# Altium project c车ccd3.0.PrjPCB
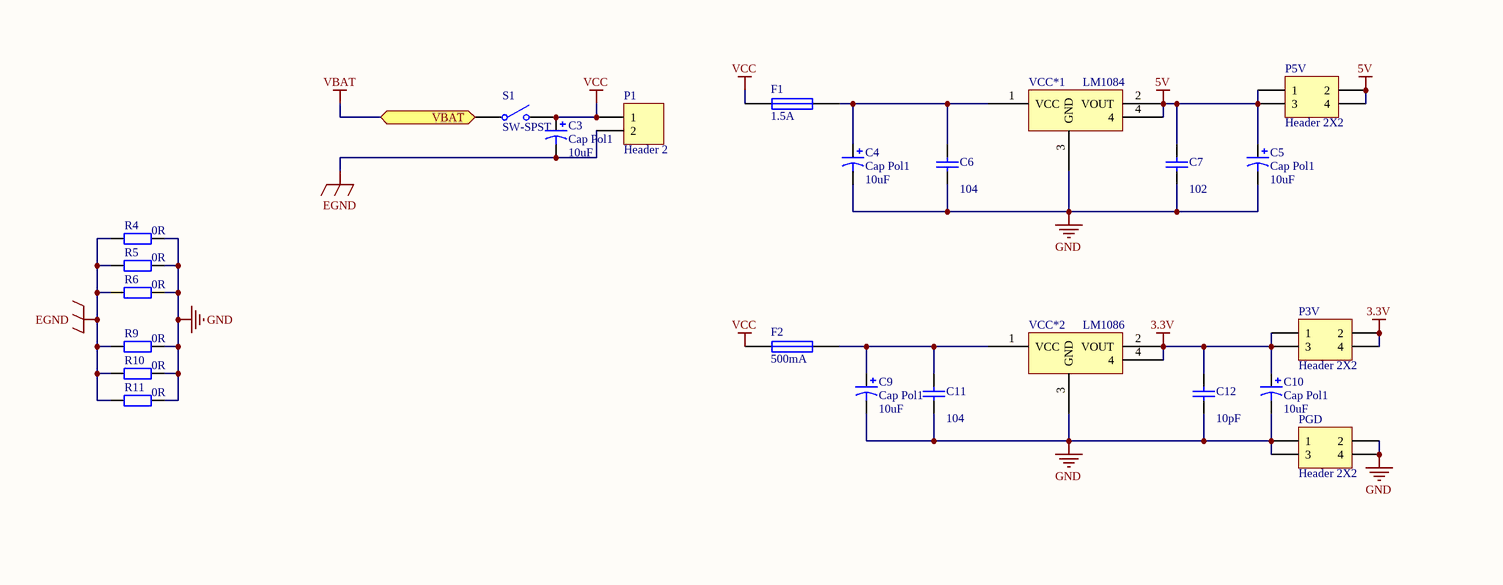
[diagram p0: k60最小系统.SchDoc, top left]
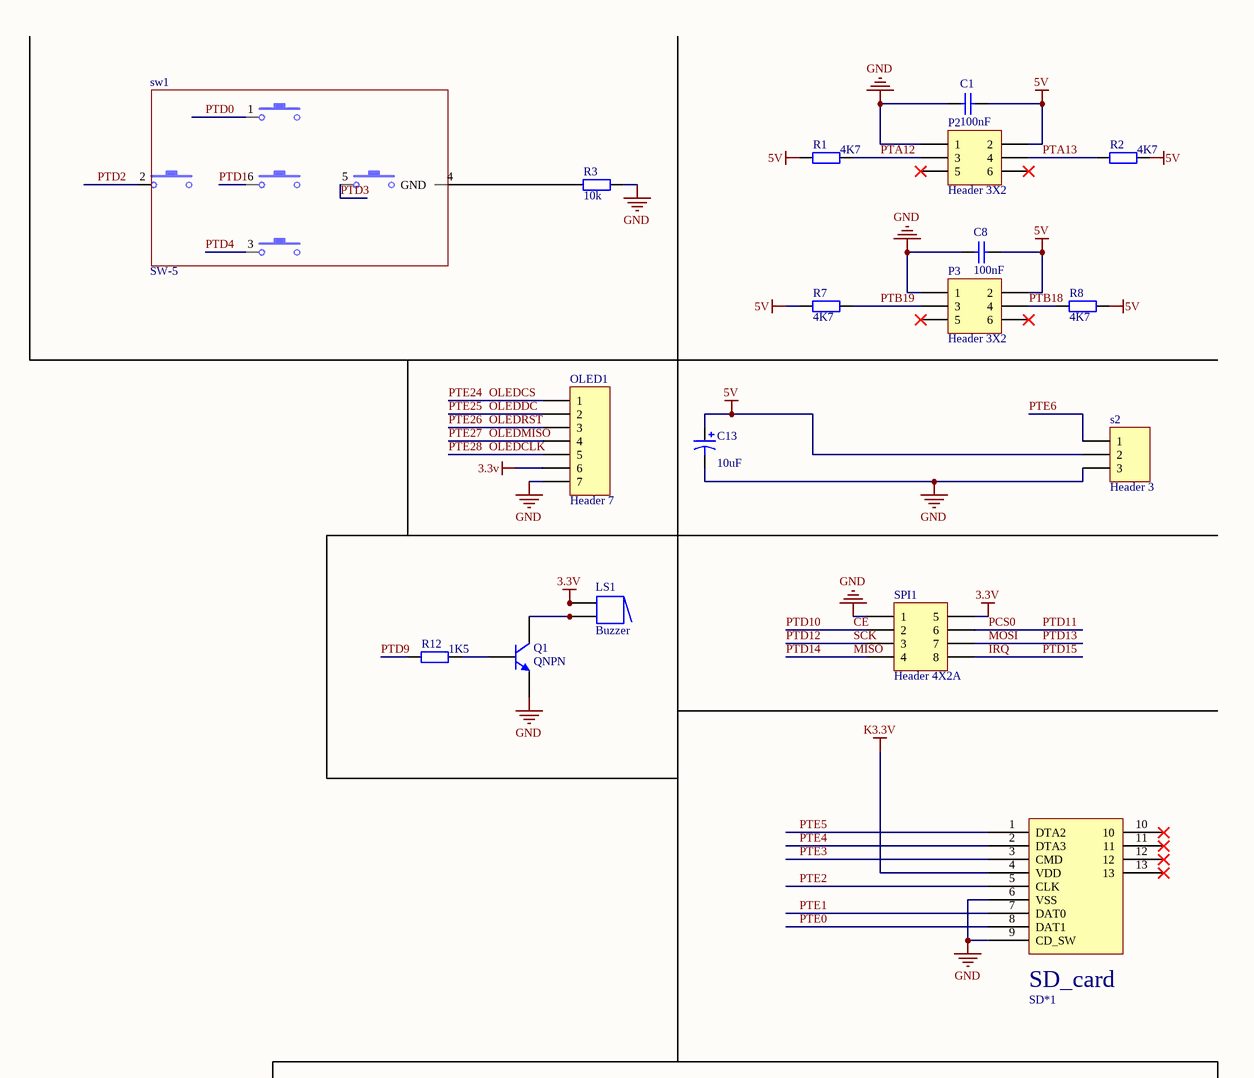
[diagram p1: k60最小系统.SchDoc, top right]
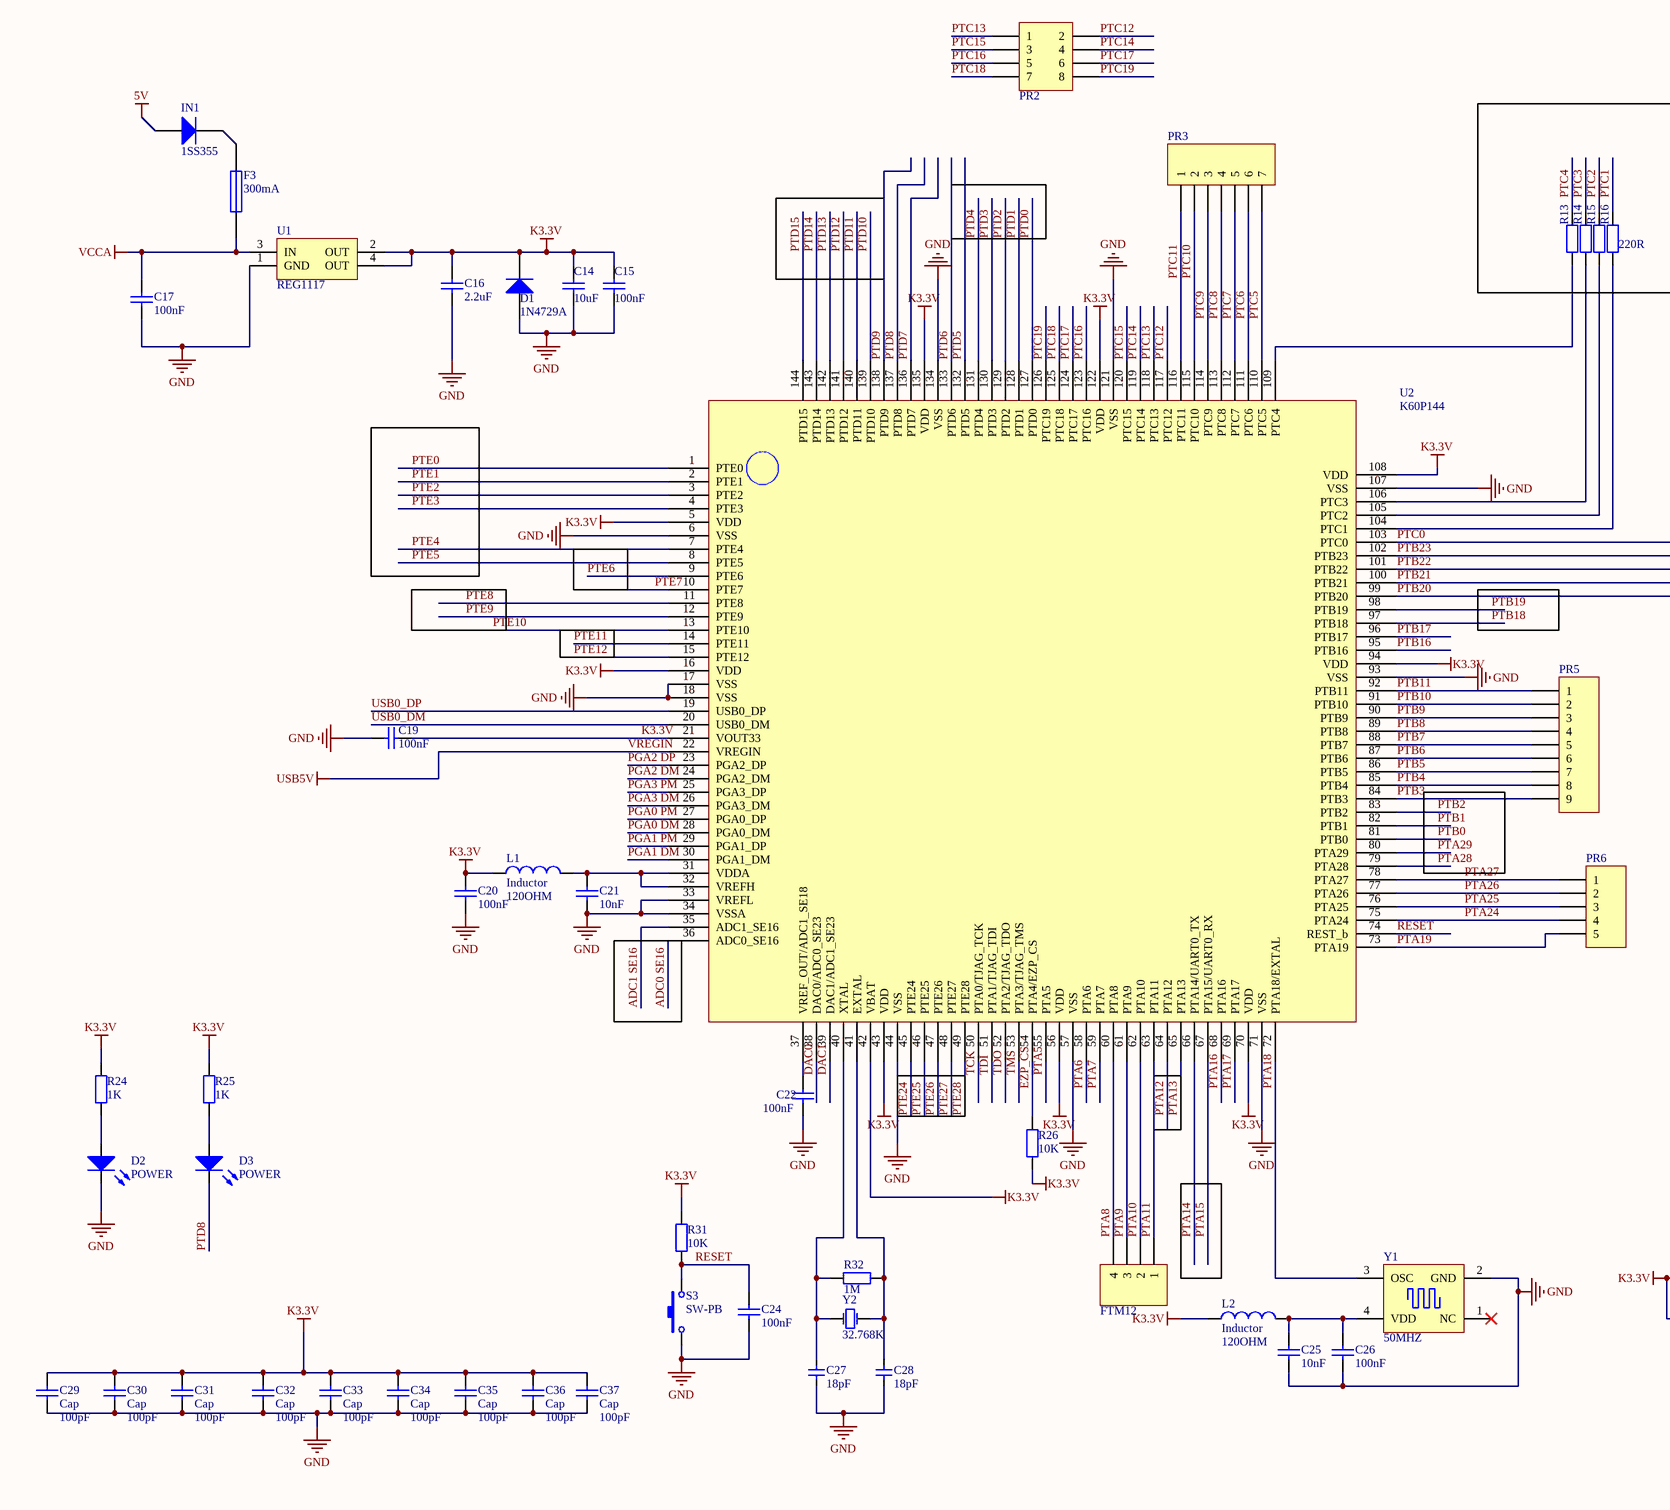
[diagram p2: k60最小系统.SchDoc, bottom left]
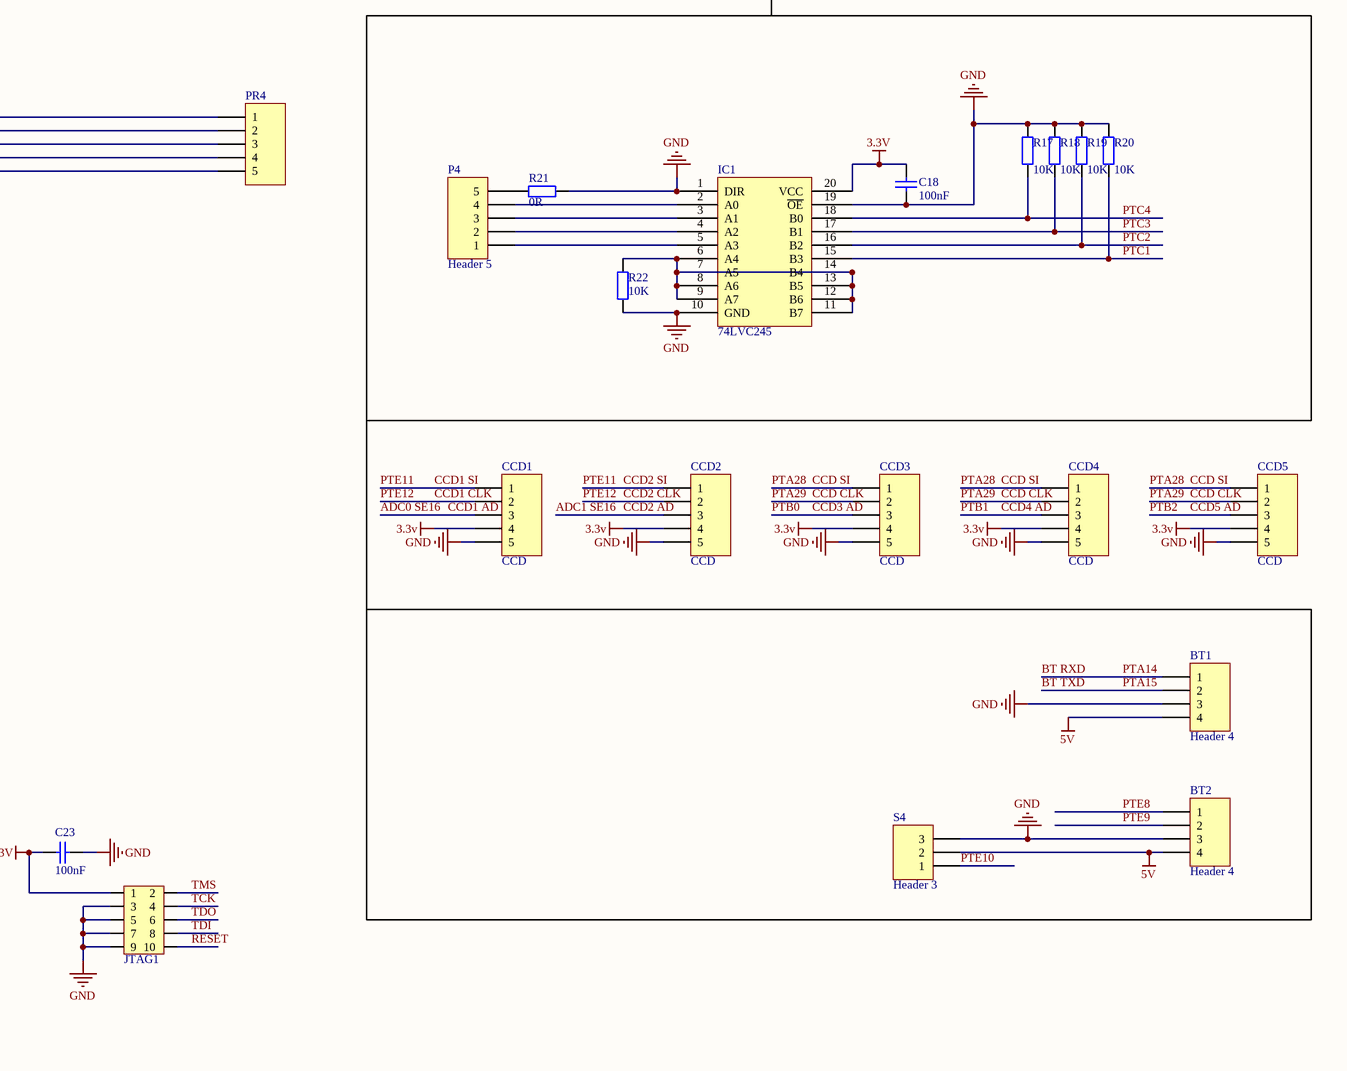
[diagram p3: k60最小系统.SchDoc, bottom right]
1 sheet, 110 parts. Net scope: flat (ports and power ports of the same name join across sheets).
Board file: c车ccd3.0.PcbDoc

## Sheet k60最小系统.SchDoc
size A2

### Parts
BT1  Header 4  [HDR1X4]
BT2  Header 4  [HDR1X4]
C1  100nF  [C2012]
C3  Cap Pol1  value 10uF  [SMD-EC-F8]
C4  Cap Pol1  value 10uF  [1206(2)]
C5  Cap Pol1  value 10uF  [1206(2)]
C6  value 104  [C2012]  (hidden comment: Cap)
C7  value 102  [C2012]  (hidden comment: Cap)
C8  100nF  [C2012]
C9  Cap Pol1  value 10uF  [1206(2)]
C10  Cap Pol1  value 10uF  [1206(2)]
C11  value 104  [C2012]  (hidden comment: Cap)
C12  value 10pF  [C2012]  (hidden comment: Cap)
C13  value 10uF  [1206(2)]  (hidden comment: Cap Pol1)
C14  10uF  [0805]
C15  100nF  [0805]
C16  2.2uF  [0805]
C17  100nF  [0805]
C18  100nF  [C2012]
C19  100nF  [c2012]
C20  100nF  [0805]
C21  10nF  [0805]
C22  100nF  [c2012]
C23  100nF  [0805]
C24  100nF  [0805]
C25  10nF  [0805]
C26  100nF  [0805]
C27  18pF  [0805]
C28  18pF  [0805]
C29  Cap  value 100pF  [C2012]
C30  Cap  value 100pF  [C2012]
C31  Cap  value 100pF  [C2012]
C32  Cap  value 100pF  [C2012]
C33  Cap  value 100pF  [C2012]
C34  Cap  value 100pF  [C2012]
C35  Cap  value 100pF  [C2012]
C36  Cap  value 100pF  [C2012]
C37  Cap  value 100pF  [C2012]
CCD1  CCD  [HDR1X5]
CCD2  CCD  [HDR1X5]
CCD3  CCD  [HDR1X5]
CCD4  CCD  [HDR1X5]
CCD5  CCD  [HDR1X5]
D1  1N4729A  [hole-chip diode]
D2  POWER  [0805]
D3  POWER  [0805]
F1  1.5A  [1206(2)]
F2  500mA  [1206(2)]
F3  300mA  [1206(2)]
FTM12  Header 4  [HDR1X4]  (value not drawn)
IC1  74LVC245  [TSSOP20 74lvc245]
IN1  1SS355  [1206(2)]
JTAG1  Header 5X2  [IDC5X2]  (value not drawn)
L1  Inductor  value 120OHM  [0805]
L2  Inductor  value 120OHM  [0805]
LS1  Buzzer  [ABSM-1574]
OLED1  Header 7  [HDR1X7]
P1  Header 2  [HDR1X2]
P2  Header 3X2  [HDR2X3]
P3  Header 3X2  [HDR2X3]
P3V  Header 2X2  [HDR2X2]
P4  Header 5  [HDR1X5]
P5V  Header 2X2  [HDR2X2]
PGD  Header 2X2  [HDR2X2]
PR2  Header 4X2  [HDR2X4]  (value not drawn)
PR3  Header 7  [HDR1X7]  (value not drawn)
PR4  Header 5  [HDR1X5]  (value not drawn)
PR5  Header 9  [HDR1X9]  (value not drawn)
PR6  Header 5  [HDR1X5]  (value not drawn)
Q1  QNPN  [SOT95P240-3N]
R1  value 4K7  [R2012]  (hidden comment: Res2)
R2  value 4K7  [R2012]  (hidden comment: Res2)
R3  10k  [R2012]
R4  value 0R  [1206(2)]  (hidden comment: Res2)
R5  value 0R  [1206(2)]  (hidden comment: Res2)
R6  value 0R  [1206(2)]  (hidden comment: Res2)
R7  value 4K7  [R2012]  (hidden comment: Res2)
R8  value 4K7  [R2012]  (hidden comment: Res2)
R9  value 0R  [1206(2)]  (hidden comment: Res2)
R10  value 0R  [1206(2)]  (hidden comment: Res2)
R11  value 0R  [1206(2)]  (hidden comment: Res2)
R12  value 1K5  [R2012]  (hidden comment: Res2)
R13  220R  [0805]  (value not drawn)
R14  220R  [0805]  (value not drawn)
R15  220R  [0805]  (value not drawn)
R16  220R  [0805]
R17  value 10K  [R2012]  (hidden comment: Res2)
R18  value 10K  [R2012]  (hidden comment: Res2)
R19  value 10K  [R2012]  (hidden comment: Res2)
R20  value 10K  [R2012]  (hidden comment: Res2)
R21  value 0R  [1206(2)]  (hidden comment: Res2)
R22  value 10K  [R2012]  (hidden comment: Res2)
R24  1K  [0805]
R25  1K  [0805]
R26  10K  [0805]
R31  10K  [0805]
R32  1M  [0805]
S1  SW-SPST  [SW-125V6A(-)]
s2  Header 3  [HDR1X3]
S3  SW-PB  [SMT_Button]
S4  Header 3  [HDR1X3]
SD*1  TF_card  [SD_card]  (value not drawn)
SPI1  Header 4X2A  [SMT head4*1]
sw1  SW-5  [SW-5]
U1  REG1117  [SOT223]
U2  K60P144  [LQFP-144]
VCC*1  LM1084  [DPAK LM2940]
VCC*2  LM1086  [DPAK LM2940]
Y1  50MHZ  [贴片有源晶体]
Y2  32.768K  [CT3215]

### Ports
VBAT

### Nets
3.3V: C10.1 C12.2 C18.1 CCD1.4 CCD2.4 CCD3.4 CCD4.4 CCD5.4 IC1.20(VCC) LS1.1 LS1.1A OLED1.6 P3V.1 P3V.2 P3V.3 P3V.4 SPI1.5 VCC*2.2(VOUT) VCC*2.4
5V: BT1.4 BT2.4 C1.2 C5.1 C7.2 C8.2 C13.1 IN1.1(A) P2.2 P3.2 P5V.1 P5V.2 P5V.3 P5V.4 R1.2 R2.1 R7.1 R8.2 s2.2 S4.2 VCC*1.2(VOUT) VCC*1.4
EGND: C3.2 P1.2 R4.2 R5.2 R6.2 R9.2 R10.2 R11.2
GND: BT1.3 BT2.3 C1.1 C4.2 C5.2 C6.1 C7.1 C8.1 C9.2 C10.2 C11.1 C12.1 C13.2 C14.1 C15.1 C16.1 C17.1 C18.2 C19.1 C20.1 C21.1 C22.1 C23.2 C24.1 C25.1 C26.1 C27.1 C28.1 C29.1 C30.1 C31.1 C32.1 C33.1 C34.1 C35.1 C36.1 C37.1 CCD1.5 CCD2.5 CCD3.5 CCD4.5 CCD5.5 D1.1(A) D2.2 IC1.1(DIR) IC1.10(GND) IC1.19(~{OE}) JTAG1.3 JTAG1.5 JTAG1.7 JTAG1.9 OLED1.7 P2.1 P3.1 PGD.1 PGD.2 PGD.3 PGD.4 Q1.3(E) R3.1 R4.1 R5.1 R6.1 R9.1 R10.1 R11.1 R17.2 R18.2 R19.2 R20.2 R21.1 R22.1 s2.3 S3.1 S4.3 SD*1.6(VSS) SD*1.9(CD_SW) SPI1.1 U1.1(GND) U2.6(VSS) U2.17(VSS) U2.18(VSS) U2.33(VREFL) U2.34(VSSA) U2.44(VSS) U2.57(VSS) U2.71(VSS) U2.93(VSS) U2.107(VSS) U2.121(VSS) U2.134(VSS) VCC*1.3(GND) VCC*2.3(GND) Y1.2(GND)
K3.3V: C14.2 C15.2 C16.2 C19.2 C20.2 C23.1 C29.2 C30.2 C31.2 C32.2 C33.2 C34.2 C35.2 C36.2 C37.2 D1.2(K) JTAG1.1 L1.1 L2.1 R24.2 R25.2 R26.1 R31.2 SD*1.4(VDD) U1.2(OUT) U1.4(OUT) U2.5(VDD) U2.16(VDD) U2.21(VOUT33) U2.42(VBAT) U2.43(VDD) U2.56(VDD) U2.70(VDD) U2.94(VDD) U2.108(VDD) U2.122(VDD) U2.135(VDD)
VBAT: S1.1(COMMON) ; port VBAT
VCC: C3.1 F1.1 F2.1 P1.1 S1.2(NO)
VCCA: C17.2 F3.1 U1.3(IN)
VREGIN: U2.22(VREGIN)  [also labelled USB5V]
ADC0 SE16: CCD1.3 U2.36(ADC0_SE16)  [also labelled CCD1 AD]
ADC1 SE16: CCD2.3 U2.35(ADC1_SE16)  [also labelled CCD2 AD]
BT RXD: BT1.1 U2.66(PTA14/UART0_TX)  [also labelled PTA14]
BT TXD: BT1.2 U2.67(PTA15/UART0_RX)  [also labelled PTA15]
CCD1 CLK: CCD1.2 CCD2.2 U2.15(PTE12)  [also labelled CCD2 CLK, PTE12]
CCD1 SI: CCD1.1 CCD2.1 U2.14(PTE11)  [also labelled CCD2 SI, PTE11]
CCD3 AD: CCD3.3 U2.81(PTB0)  [also labelled PTB0]
CCD4 AD: CCD4.3 U2.82(PTB1)  [also labelled PTB1]
CCD5 AD: CCD5.3 U2.83(PTB2)  [also labelled PTB2]
CCD CLK: CCD3.2 CCD4.2 CCD5.2 U2.80(PTA29)  [also labelled PTA29]
CCD SI: CCD3.1 CCD4.1 CCD5.1 U2.79(PTA28)  [also labelled PTA28]
CE: SPI1.2 U2.139(PTD10)  [also labelled PTD10]
DAC0: U2.38(DAC0/ADC0_SE23)
DAC1: U2.39(DAC1/ADC1_SE23)
EZP_CS: R26.2 U2.54(PTA4/EZP_CS)
IRQ: SPI1.8 U2.144(PTD15)  [also labelled PTD15]
MISO: SPI1.4 U2.143(PTD14)  [also labelled PTD14]
MOSI: SPI1.7 U2.142(PTD13)  [also labelled PTD13]
OLEDCLK: OLED1.5 U2.49(PTE28)  [also labelled PTE28]
OLEDCS: OLED1.1 U2.45(PTE24)  [also labelled PTE24]
OLEDDC: OLED1.2 U2.46(PTE25)  [also labelled PTE25]
OLEDMISO: OLED1.4 U2.48(PTE27)  [also labelled PTE27]
OLEDRST: OLED1.3 U2.47(PTE26)  [also labelled PTE26]
PCS0: SPI1.6 U2.140(PTD11)  [also labelled PTD11]
PGA0 DM: U2.28(PGA0_DM)
PGA0 PM: U2.27(PGA0_DP)
PGA1 DM: U2.30(PGA1_DM)
PGA1 PM: U2.29(PGA1_DP)
PGA2 DM: U2.24(PGA2_DM)
PGA2 DP: U2.23(PGA2_DP)
PGA3 DM: U2.26(PGA3_DM)
PGA3 PM: U2.25(PGA3_DP)
PTA5: U2.55(PTA5)
PTA6: U2.58(PTA6)
PTA7: U2.59(PTA7)
PTA8: FTM12.4 U2.60(PTA8)
PTA9: FTM12.3 U2.61(PTA9)
PTA10: FTM12.2 U2.62(PTA10)
PTA11: FTM12.1 U2.63(PTA11)
PTA12: P2.3 R1.1 U2.64(PTA12)
PTA13: P2.4 R2.2 U2.65(PTA13)
PTA16: U2.68(PTA16)
PTA17: U2.69(PTA17)
PTA18: U2.72(PTA18/EXTAL) Y1.3(OSC)
PTA19: PR6.5 U2.73(PTA19)
PTA24: PR6.4 U2.75(PTA24)
PTA25: PR6.3 U2.76(PTA25)
PTA26: PR6.2 U2.77(PTA26)
PTA27: PR6.1 U2.78(PTA27)
PTB3: PR5.9 U2.84(PTB3)
PTB4: PR5.8 U2.85(PTB4)
PTB5: PR5.7 U2.86(PTB5)
PTB6: PR5.6 U2.87(PTB6)
PTB7: PR5.5 U2.88(PTB7)
PTB8: PR5.4 U2.89(PTB8)
PTB9: PR5.3 U2.90(PTB9)
PTB10: PR5.2 U2.91(PTB10)
PTB11: PR5.1 U2.92(PTB11)
PTB16: U2.95(PTB16)
PTB17: U2.96(PTB17)
PTB18: P3.4 R8.1 U2.97(PTB18)
PTB19: P3.3 R7.2 U2.98(PTB19)
PTB20: PR4.5 U2.99(PTB20)
PTB21: PR4.4 U2.100(PTB21)
PTB22: PR4.3 U2.101(PTB22)
PTB23: PR4.2 U2.102(PTB23)
PTC0: PR4.1 U2.103(PTC0)
PTC1: IC1.15(B3) R16.2 R20.1
PTC2: IC1.16(B2) R15.2 R19.1
PTC3: IC1.17(B1) R14.2 R18.1
PTC4: IC1.18(B0) R13.2 R17.1
PTC5: PR3.7 U2.110(PTC5)
PTC6: PR3.6 U2.111(PTC6)
PTC7: PR3.5 U2.112(PTC7)
PTC8: PR3.4 U2.113(PTC8)
PTC9: PR3.3 U2.114(PTC9)
PTC10: PR3.2 U2.115(PTC10)
PTC11: PR3.1 U2.116(PTC11)
PTC12: PR2.2 U2.117(PTC12)
PTC13: PR2.1 U2.118(PTC13)
PTC14: PR2.4 U2.119(PTC14)
PTC15: PR2.3 U2.120(PTC15)
PTC16: PR2.5 U2.123(PTC16)
PTC17: PR2.6 U2.124(PTC17)
PTC18: PR2.7 U2.125(PTC18)
PTC19: PR2.8 U2.126(PTC19)
PTD0: sw1.1 U2.127(PTD0)
PTD1: sw1.6 U2.128(PTD1)
PTD2: sw1.2 U2.129(PTD2)
PTD3: sw1.5 U2.130(PTD3)
PTD4: sw1.3 U2.131(PTD4)
PTD5: U2.132(PTD5)
PTD6: U2.133(PTD6)
PTD7: U2.136(PTD7)
PTD8: D3.2 U2.137(PTD8)
PTD9: R12.2 U2.138(PTD9)
PTD12: SPI1.3 U2.141(PTD12)  [also labelled SCK]
PTE0: SD*1.8(DAT1) U2.1(PTE0)
PTE1: SD*1.7(DAT0) U2.2(PTE1)
PTE2: SD*1.5(CLK) U2.3(PTE2)
PTE3: SD*1.3(CMD) U2.4(PTE3)
PTE4: SD*1.2(DTA3) U2.7(PTE4)
PTE5: SD*1.1(DTA2) U2.8(PTE5)
PTE6: s2.1 U2.9(PTE6)
PTE7: U2.10(PTE7)
PTE8: BT2.1 U2.11(PTE8)
PTE9: BT2.2 U2.12(PTE9)
PTE10: S4.1 U2.13(PTE10)
RESET: C24.2 JTAG1.10 R31.1 S3.2 U2.74(REST_b)
TCK: JTAG1.4 U2.50(PTA0/TJAG_TCK)
TDI: JTAG1.8 U2.51(PTA1/TJAG_TDI)
TDO: JTAG1.6 U2.52(PTA2/TJAG_TDO)
TMS: JTAG1.2 U2.53(PTA3/TJAG_TMS)
USB0_DM: U2.20(USB0_DM)
USB0_DP: U2.19(USB0_DP)
NetC4_1: C4.1 C6.2 F1.2 VCC*1.1(VCC)
NetC9_1: C9.1 C11.2 F2.2 VCC*2.1(VCC)
NetC21_2: C21.2 L1.2 U2.31(VDDA) U2.32(VREFH)
NetC22_2: C22.2 U2.37(VREF_OUT/ADC1_SE18)
NetC25_2: C25.2 C26.2 L2.2 Y1.4(VDD)
NetC27_2: C27.2 R32.1 U2.40(XTAL) Y2.1(OSC1)
NetC28_2: C28.2 R32.2 U2.41(EXTAL) Y2.2(OSC2)
NetD2_1: D2.1 R24.1
NetD3_1: D3.1 R25.1
NetF3_2: F3.2 IN1.2(K)
NetIC1_2: IC1.2(A0) P4.4
NetIC1_3: IC1.3(A1) P4.3
NetIC1_4: IC1.4(A2) P4.2
NetIC1_5: IC1.5(A3) P4.1
NetIC1_6: IC1.6(A4) IC1.7(A5) IC1.8(A6) IC1.9(A7) IC1.11(B7) IC1.12(B6) IC1.13(B5) IC1.14(B4) R22.2
NetLS1_2: LS1.2 LS1.2A Q1.1(C)
NetP4_5: P4.5 R21.2
NetQ1_2: Q1.2(B) R12.1
NetR3_2: R3.2 sw1.4(GND)
NetR13_1: R13.1 U2.109(PTC4)
NetR14_1: R14.1 U2.106(PTC3)
NetR15_1: R15.1 U2.105(PTC2)
NetR16_1: R16.1 U2.104(PTC1)

Not connected (* = marked no-connect by the designer): P2 5* 6*; P3 5* 6*; SD*1 10* 11* 12* 13*; Y1 1(NC)*

### Notes on the sheet
- (in symbol TF_card) SD_card

### Library data of the parts
BT1 BT2 FTM12 = Header 4: Header, 4-Pin; LatestRevisionDate: 17-Jul-2002; LatestRevisionNote: Re-released for DXP Platform.; Publisher: Altium Limited
C1 C8 C14-C26 = Cap: Capacitor
C3-C5 C9 C10 C13 = Cap Pol1: Polarized Capacitor (Radial); Published: 8-Jun-2000; LatestRevisionDate: 17-Jul-2002; LatestRevisionNote: Re-released for DXP Platform.; PackageReference: RB7.6-15; Publisher: Altium Limited; PackageDescription: Polarized Capacitor (Radial); 2 Leads
C6 C7 C11 C12 C29-C37 = Cap: 贴片电容; Published: 8-Jun-2000; LatestRevisionDate: 17-Jul-2002; LatestRevisionNote: Re-released for DXP Platform.; PackageReference: RAD-0.3; Publisher: Altium Limited
C27 C28 = 陶瓷电容: CAP
CCD1-CCD5 P4 PR4 PR6 = Header 5: Header, 5-Pin; LatestRevisionDate: 17-Jul-2002; LatestRevisionNote: Re-released for DXP Platform.; Publisher: Altium Limited
D1 IN1 = Diode 1N4148: High Conductance Fast Diode; LatestRevisionDate: 17-Jul-2002; LatestRevisionNote: Re-released for DXP Platform.; DatasheetDocument: 1997; PackageReference: DO-35; Publisher: Altium Limited; Code_JEDEC: DO-204-AH; ComponentLink1Description: Manufacturer Link; ComponentLink2Description: Datasheet; ComponentLink2URL: http://www.fairchildsemi.com/ds/1N%2F1N4148.pdf
D2 D3 = LED: Typical INFRARED GaAs LED
F1-F3 = Fuse 1: Fuse; Published: 8-Jun-2000; LatestRevisionDate: 17-Jul-2002; LatestRevisionNote: Re-released for DXP Platform.; PackageReference: PIN-W2/E2.8; Publisher: Altium Limited
JTAG1 = Header 5X2: Header, 5-Pin, Dual row
L1 L2 = Inductor: Code_IEC: 1005; Published: 8-Jun-2000; LatestRevisionDate: 29-May-2009; LatestRevisionNote: IPC-7351 Footprint Added.; PackageReference: 0402-A; Publisher: Altium Limited; PackageDescription: Chip Inductor; Code_JEITA: 0402
LS1 = Buzzer: Magnetic Transducer Buzzer; pin to pad: 1>1A 2>2A; Published: 24-Mar-1999; LatestRevisionDate: 17-Dec-2003; LatestRevisionNote: Schematic revised, PCB Footprint replaced.; DatasheetVersion: 17-Dec-2003; PackageReference: ABSM-1574; Publisher: Altium Limited; ComponentLink1Description: Manufacturer Link; ComponentLink1URL: http://www.megastar.com/linecard/buzzmode/index.php
OLED1 PR3 = Header 7: Header, 7-Pin; LatestRevisionDate: 17-Jul-2002; LatestRevisionNote: Re-released for DXP Platform.; Publisher: Altium Limited
P1 = Header 2: Header, 2-Pin; LatestRevisionDate: 17-Jul-2002; LatestRevisionNote: Re-released for DXP Platform.; Publisher: Altium Limited
P2 P3 = Header 3X2: Header, 3-Pin, Dual row; LatestRevisionDate: 17-Jul-2002; LatestRevisionNote: Re-released for DXP Platform.; Publisher: Altium Limited
P3V P5V PGD = Header 2X2: Header, 2-Pin, Dual row; LatestRevisionDate: 17-Jul-2002; LatestRevisionNote: Re-released for DXP Platform.; Publisher: Altium Limited
PR2 = Header 4X2: Header, 4-Pin, Dual row; LatestRevisionDate: 17-Jul-2002; LatestRevisionNote: Re-released for DXP Platform.; Publisher: Altium Limited
PR5 = Header 9: Header, 9-Pin; LatestRevisionDate: 17-Jul-2002; LatestRevisionNote: Re-released for DXP Platform.; Publisher: Altium Limited
Q1 = QNPN: NPN Bipolar Transistor; pin to pad: 1>3 2>1 3>2; Published: 8-Jun-2000; LatestRevisionDate: 29-May-2009; LatestRevisionNote: IPC-7351 Footprint Added.; PackageVersion: Aug-1999; PackageReference: SOT-23B; Publisher: Altium Limited; PackageDescription: 3-Pin SOT-23 Package 0.95 mm Pitch, 2.4 mm Lead Span
R1 R2 R4-R12 R17-R22 = Res2: Resistor; Published: 8-Jun-2000; LatestRevisionDate: 17-Jul-2002; LatestRevisionNote: Re-released for DXP Platform.; PackageReference: AXIAL-0.4; Publisher: Altium Limited; PackageDescription: Axial Device, Thru-Hole; 2 Leads; 0.4 in Pin Spacing
R3 = Res: Resistor of led
R13-R16 R24-R26 R31 R32 = Res: Resistor
S1 = SW-SPST: Single-Pole, Single-Throw Switch; pin to pad: 1>2 2>1; Published: 24-Mar-1999; LatestRevisionDate: 17-Jul-2002; LatestRevisionNote: Re-released for DXP Platform.; PackageReference: SPST-2; Publisher: Altium Limited
s2 S4 = Header 3: Header, 3-Pin; LatestRevisionDate: 17-Jul-2002; LatestRevisionNote: Re-released for DXP Platform.; Publisher: Altium Limited
S3 = SW-PB: Switch
SPI1 = Header 4X2A: Header, 4-Pin, Dual row; LatestRevisionDate: 17-Jul-2002; LatestRevisionNote: Re-released for DXP Platform.; Publisher: Altium Limited
U1 = REG1117: 800mA and 1A Low Dropout Positive Regulator 2.85V, 3.3V, 5V, and Adjustable; Published: 8-Jun-2000; LatestRevisionDate: 17-Jul-2002; LatestRevisionNote: Re-released for DXP Platform.; DatasheetVersion: Sep-1997; PackageVersion: revC; PackageReference: ZZ311; Publisher: Altium Limited; PackageDescription: SOT-223/SC-73; 4 Leads; Body 6.7 x 7.3 mm, inc. leads (LxW max); ComponentLink1Description: Manufacturer Link; ComponentLink1URL: http://www.ti.com/; ComponentLink2Description: Datasheet; ComponentLink2URL: http://www-s.ti.com/sc/ds/REG1117.pdf
VCC*1 VCC*2 = LM1086: pin to pad: 1>3 3>1
Y1 = XTAL1
Y2 = XTAL: Crystal Oscillator